# EAGLE design OpAmp_NonInvertente (EAGLE 7.2.0)
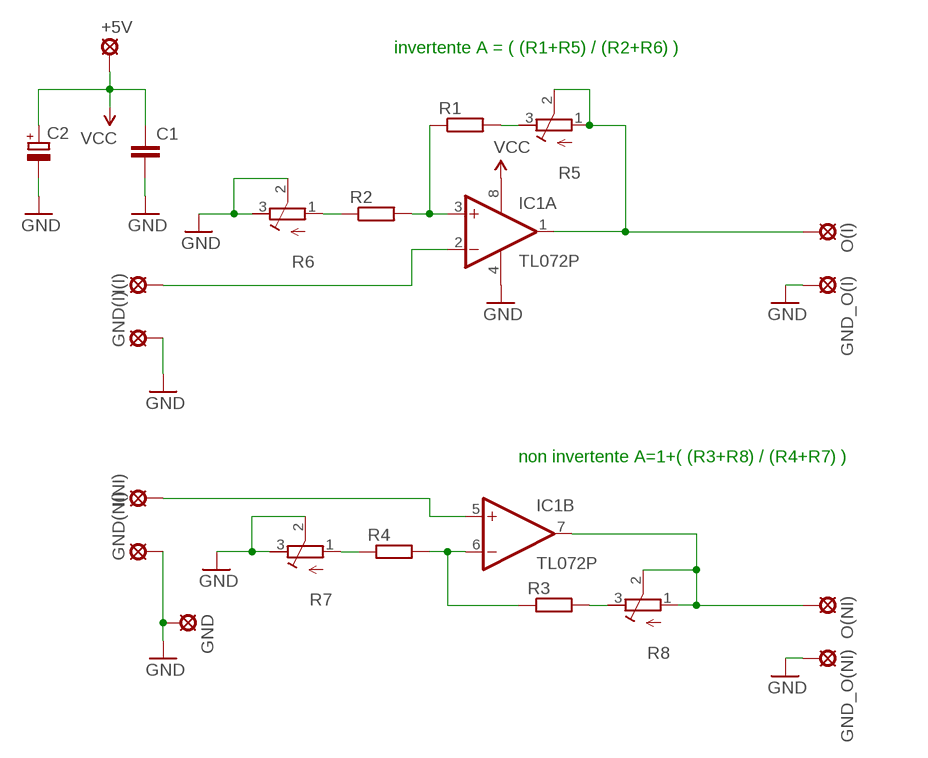
[diagram p0: schematic, sheet 1]

## Parts
+5V  LSP10  [LSP10]
C1  C-EU025-024X044  [C025-024X044]
C2  CPOL-EUE2.5-6  [E2,5-6]
GND  LSP10  [LSP10]
GND(I)  LSP10  [LSP10]
GND(NI)  LSP10  [LSP10]
GND_O(I)  LSP10  [LSP10]
GND_O(NI)  LSP10  [LSP10]
I(I)  LSP10  [LSP10]
I(NI)  LSP10  [LSP10]
IC1  TL072P  [DIL08]
O(I)  LSP10  [LSP10]
O(NI)  LSP10  [LSP10]
R1  R-EU_0309/10  [0309/10]
R2  R-EU_0309/10  [0309/10]
R3  R-EU_0309/10  [0309/10]
R4  R-EU_0309/10  [0309/10]
R5  R-TRIMM3339P  [RTRIM3339P]
R6  R-TRIMM3339P  [RTRIM3339P]
R7  R-TRIMM3339P  [RTRIM3339P]
R8  R-TRIMM3339P  [RTRIM3339P]

## Nets
GND: C1.2 C2.- GND(I).MP GND(NI).MP GND.MP GND_O(I).MP GND_O(NI).MP IC1.4(P:V-) R6.2(S) R6.3(E) R7.2(S) R7.3(E)
N$2: R2.1 R6.1(A)
N$3: IC1.3(A:+IN) R1.1 R2.2
N$4: R1.2 R5.3(E)
N$5: IC1.1(A:OUT) O(I).MP R5.1(A) R5.2(S)
N$7: IC1.6(B:-IN) R3.1 R4.2
N$8: R4.1 R7.1(A)
N$11: R3.2 R8.3(E)
N$12: IC1.7(B:OUT) O(NI).MP R8.1(A) R8.2(S)
N$13: I(NI).MP IC1.5(B:+IN)
N$14: I(I).MP IC1.2(A:-IN)
VCC: +5V.MP C1.1 C2.+ IC1.8(P:V+)

## Notes on the sheet
- invertente A = ( (R1+R5) / (R2+R6) )
- non invertente A=1+( (R3+R8) / (R4+R7) )

## Library data of the parts
+5V GND GND(I) GND(NI) GND_O(I) GND_O(NI) I(I) I(NI) O(I) O(NI) = solpad:LSP10: SOLDER PAD drill 1.0 mm, distributor Buerklin, 12H555
C1 = rcl:C-EU: CAPACITOR, European symbol
C2 = rcl:CPOL-EU: POLARIZED CAPACITOR, European symbol
IC1 = linear:TL072: OP AMP
R1-R4 = rcl:R-EU_: RESISTOR, European symbol
R5-R8 = rcl:R-TRIMM: Trimm resistor

## Board
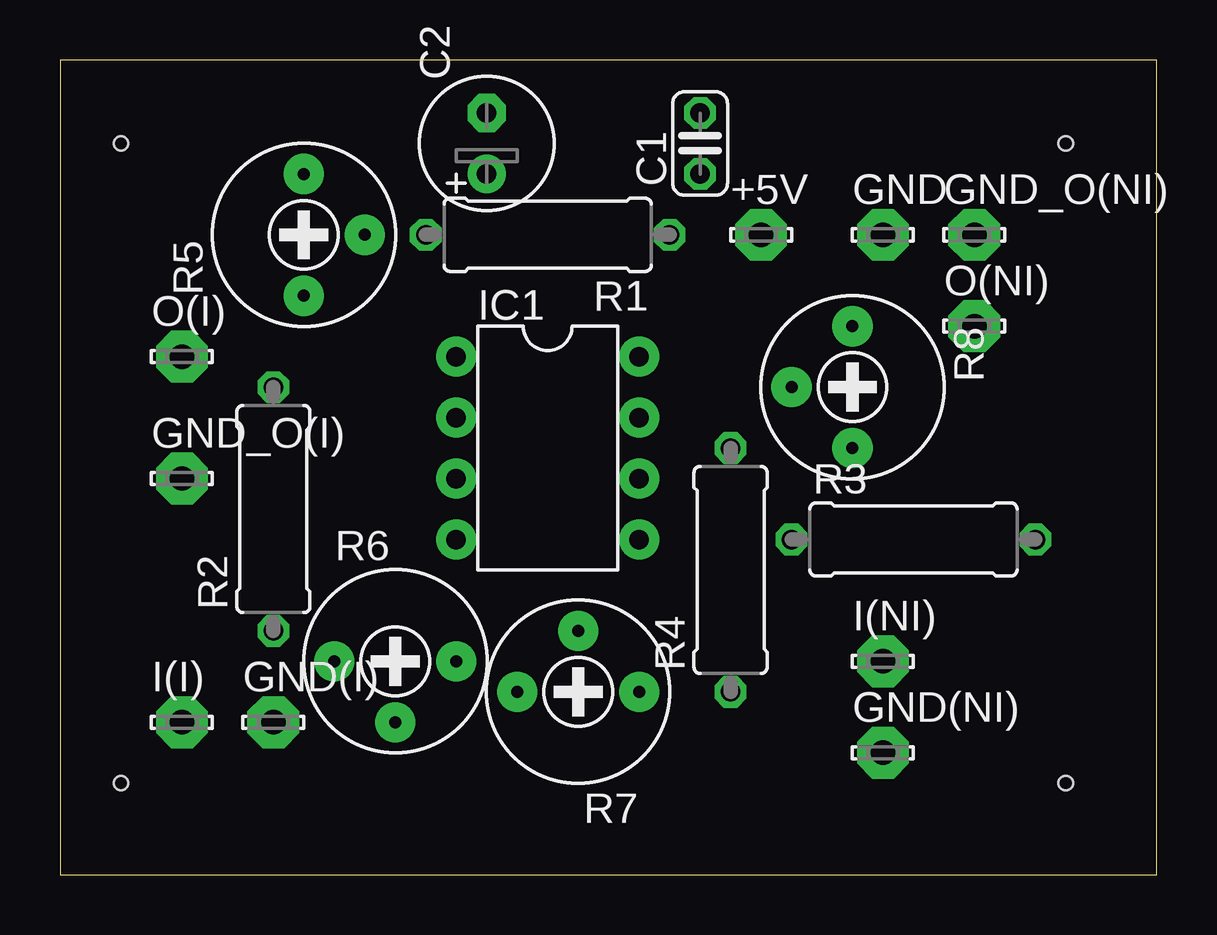
[diagram p1: board, top side]
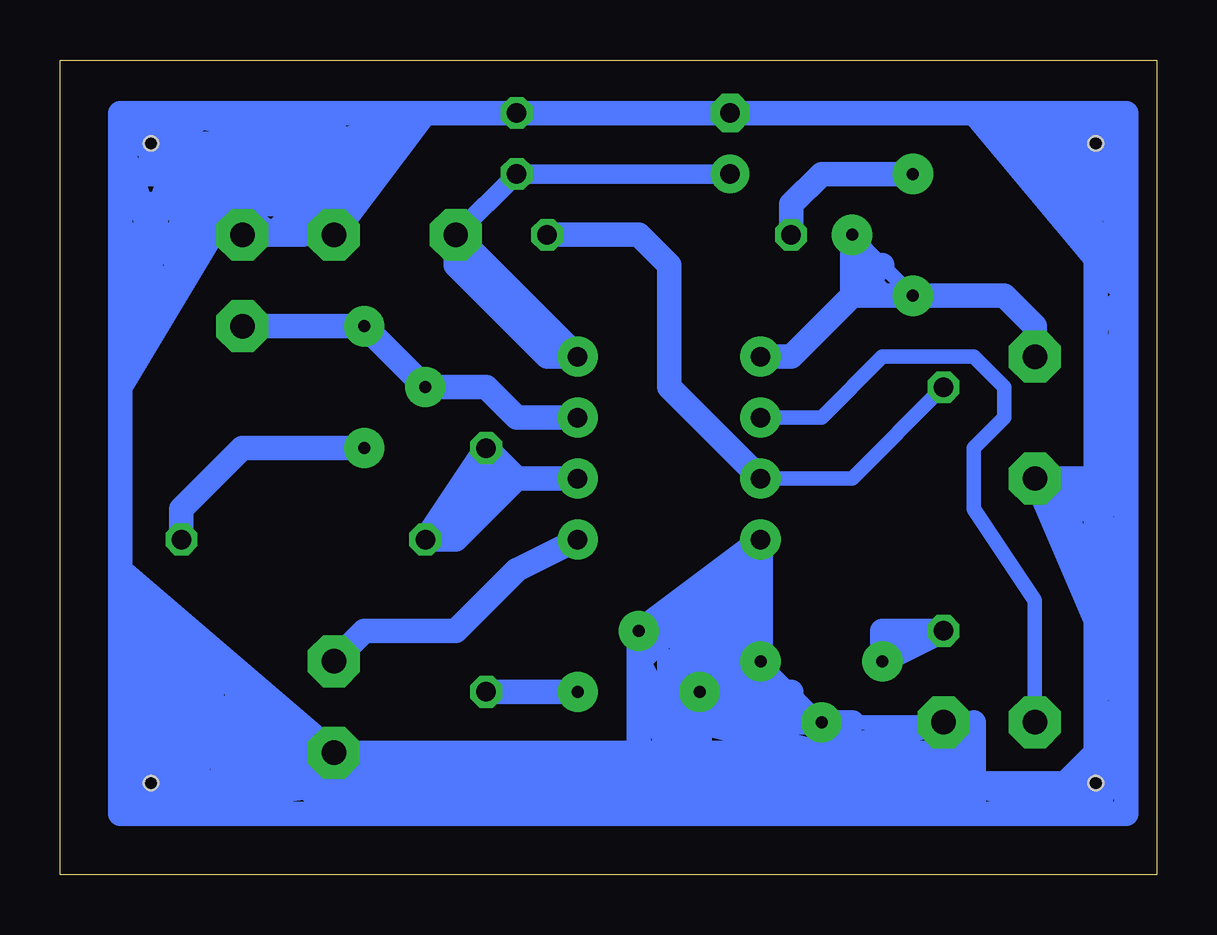
[diagram p2: board, bottom side, seen from below]

Size 45.7 x 33.96 mm. Coordinates in mm from the lower left corner, seen from the top.
Outline: 0,0 45.7,0 45.7,33.96 0,33.96 0,0
Copper layers (1*16): Top 0.035mm / dielectric 1.5mm / Bottom 0.035mm
Design rules "default": minimum track width 10mil, minimum drill 24mil, track to track 8mil, track to pad 8mil, pad to pad 8mil, via to via 8mil, smd to smd 8mil, copper to edge 40mil, drill to drill 8mil, minimum pad ring 10mil, minimum via ring 8mil, stop-mask expansion 4mil, vias tented up to drill 0mil, thermal gap 10mil
Holes 0.6 mm at 2.54,30.48 2.54,3.81 41.91,3.81 41.91,30.48

### Footprints (pad centres in the part's own frame; a part is rotated, then mirrored left to right if it is on the bottom)
LSP10 = drill 1.016 pad 2.159 octagon: MP 0,0
C025-024X044 = drill 0.813 octagon: 1 -1.27,0; 2 1.27,0
E2,5-6 = drill 0.813 pad 1.6: + -1.27,0 | drill 0.813 pad 1.6 octagon: - 1.27,0
DIL08 = drill 0.813 pad 1.676: 1 -3.81,-3.81; 2 -1.27,-3.81; 3 1.27,-3.81; 4 3.81,-3.81; 5 3.81,3.81; 6 1.27,3.81; 7 -1.27,3.81; 8 -3.81,3.81
0309/10 = drill 0.813 octagon: 1 -5.08,0; 2 5.08,0
RTRIM3339P = drill 0.5 pad 1.676: 1 -2.54,0; 2 0,-2.54; 3 2.54,0

### Placement (x,y rotation side)
+5V  29.21,26.67 0 top
C1  26.67,30.48 90 top
C2  17.78,30.48 90 top
GND  34.29,26.67 0 top
GND(I)  8.89,6.35 0 top
GND(NI)  34.29,5.08 0 top
GND_O(I)  5.08,16.51 0 top
GND_O(NI)  38.1,26.67 0 top
I(I)  5.08,6.35 0 top
I(NI)  34.29,8.89 0 top
IC1  20.32,17.78 270 top
O(I)  5.08,21.59 0 top
O(NI)  38.1,22.86 0 top
R1  20.32,26.67 180 top
R2  8.89,15.24 90 top
R3  35.56,13.97 0 top
R4  27.94,12.7 90 top
R5  10.16,26.67 90 top
R6  13.97,8.89 0 top
R7  21.59,7.62 180 top
R8  33.02,20.32 270 top

### Tracks (layer width: path | path; a pad name or v marks a point on that pad's centre or on a via)
GND
  Bottom 0.61: GND.MP 35.56,26.67 36.83,26.67 GND_O(NI).MP | R7.3 17.78,7.62 R6.3 15.24,7.62 R6.2 | 16.51,12.7 16.51,10.16 | 12.7,6.35 GND(I).MP | 20.32,5.08 19.05,6.35 R7.3 | R7.3 19.05,8.89
  Bottom 1.016: 3.81,31.75 1.27,31.75 1.27,30.48 | 3.81,31.75 5.08,31.75 | 5.08,31.75 6.35,31.75 | 6.35,31.75 7.62,31.75 | 7.62,31.75 C2.- C1.2 30.48,31.75 | 30.48,31.75 34.29,31.75 | 34.29,31.75 35.56,31.75 | 35.56,31.75 39.37,31.75 | 39.37,31.75 40.64,31.75 | 40.64,31.75 43.18,31.75 43.18,30.48 | 43.18,30.48 43.18,29.21 | 43.18,29.21 43.18,27.94 | 43.18,27.94 43.18,26.67 | 43.18,26.67 43.18,25.4 | 43.18,25.4 43.18,20.32 | 43.18,20.32 43.18,12.7 | 43.18,12.7 43.18,11.43 | 43.18,11.43 43.18,3.81 | 43.18,2.54 41.91,2.54 | 41.91,2.54 39.37,2.54 | 39.37,2.54 34.29,2.54 | 34.29,2.54 8.89,2.54 | 8.89,2.54 7.62,2.54 | 7.62,2.54 5.08,2.54 | 5.08,2.54 3.81,2.54 | 3.81,2.54 2.54,2.54 | 2.54,2.54 1.27,2.54 1.27,6.35 | 1.27,6.35 1.27,7.62 | 1.27,7.62 1.27,15.24 | 1.27,15.24 1.27,16.51 | 1.27,16.51 1.27,24.13 | 1.27,24.13 1.27,26.67 | 1.27,26.67 1.27,30.48 | 3.81,16.51 GND_O(I).MP 1.27,7.62 | 3.81,16.51 2.54,16.51 | 2.54,16.51 1.27,16.51 | 39.37,26.67 GND_O(NI).MP 35.56,26.67 35.56,27.94 | 39.37,26.67 40.64,26.67 | 40.64,26.67 41.91,26.67 | 41.91,26.67 43.18,26.67 | 8.89,5.08 GND(I).MP 13.97,5.08 | 8.89,5.08 8.89,3.81 | 8.89,3.81 8.89,2.54 | R6.2 15.24,6.35 | 15.24,6.35 16.51,6.35 | 16.51,6.35 19.05,6.35 | R6.3 16.51,7.62 | 16.51,7.62 16.51,6.35 | 15.24,6.35 15.24,7.62 16.51,7.62 | 16.51,7.62 17.78,7.62 19.05,6.35 | 19.05,6.35 16.51,7.62 | 16.51,7.62 15.24,6.35 | GND(NI).MP 34.29,3.81 | 34.29,2.54 34.29,3.81 | 8.89,5.08 12.7,5.08 | 12.7,5.08 13.97,5.08 | 19.05,5.08 20.32,5.08 | 20.32,5.08 21.59,5.08 | 21.59,5.08 GND(NI).MP | 7.62,2.54 7.62,3.81 | 7.62,3.81 7.62,6.35 8.89,3.81 | 8.89,3.81 7.62,2.54 | 13.97,5.08 19.05,6.35 | 19.05,6.35 19.05,5.08 | 19.05,5.08 13.97,5.08 | 12.7,5.08 R6.2 | R6.2 12.7,6.35
  Bottom 1.016: 1.27,7.62 2.54,16.51 | 2.54,16.51 3.81,15.24 | 3.81,15.24 2.54,11.43 | 2.54,11.43 2.54,15.24 | 2.54,15.24 3.81,15.24 | 3.81,15.24 3.81,16.51 | 3.81,16.51 1.27,15.24 | 34.29,27.94 GND.MP 30.48,31.75 | 34.29,27.94 34.29,29.21 | 34.29,30.48 34.29,31.75 | 43.18,30.48 41.91,30.48 | 41.91,30.48 40.64,30.48 | 40.64,30.48 39.37,30.48 | 39.37,30.48 34.29,30.48 | 34.29,29.21 36.83,29.21 | 36.83,29.21 40.64,29.21 | 40.64,29.21 41.91,29.21 | 41.91,29.21 43.18,29.21 | 43.18,27.94 40.64,27.94 | 40.64,27.94 36.83,27.94 | 36.83,27.94 35.56,27.94 | 35.56,27.94 34.29,27.94 | 35.56,31.75 35.56,27.94 | 35.56,27.94 34.29,30.48 | 34.29,30.48 40.64,31.75 | 40.64,31.75 43.18,30.48 | 43.18,30.48 41.91,26.67 | 41.91,26.67 40.64,30.48 | 40.64,30.48 41.91,29.21 | 41.91,29.21 41.91,30.48 | 41.91,30.48 39.37,31.75 | 39.37,31.75 34.29,30.48 | 34.29,30.48 40.64,29.21 | 40.64,29.21 39.37,30.48 | 39.37,30.48 39.37,26.67 | 39.37,26.67 40.64,27.94 | 40.64,27.94 40.64,26.67 | 40.64,27.94 40.64,29.21 | 40.64,29.21 36.83,27.94 | 36.83,27.94 36.83,29.21 | 36.83,29.21 35.56,27.94 | 35.56,27.94 40.64,29.21 | 40.64,29.21 36.83,26.67 35.56,27.94 | GND(NI).MP 43.18,12.7 | 43.18,12.7 41.91,2.54 | 41.91,2.54 38.1,7.62 | 38.1,7.62 41.91,10.16 40.64,6.35 | 40.64,6.35 39.37,2.54 | 39.37,2.54 38.1,7.62 | 38.1,7.62 35.56,3.81 36.83,3.81 | 36.83,3.81 38.1,3.81 | 38.1,3.81 40.64,3.81 | 40.64,3.81 43.18,3.81 | 43.18,3.81 43.18,2.54 | 43.18,2.54 34.29,3.81 | 34.29,3.81 36.83,6.35 36.83,5.08 | 36.83,5.08 36.83,3.81 | 36.83,3.81 39.37,6.35 | 39.37,6.35 40.64,7.62 40.64,8.89 39.37,6.35 | 39.37,6.35 39.37,8.89 43.18,11.43 | 43.18,11.43 40.64,3.81 | 40.64,3.81 41.91,5.08 43.18,2.54 | 43.18,2.54 39.37,5.08 | 39.37,5.08 40.64,6.35
  Bottom 1.016: 39.37,5.08 38.1,3.81 | 38.1,3.81 38.1,6.35 36.83,5.08 | 36.83,5.08 34.29,2.54 | 7.62,31.75 1.27,24.13 | 1.27,24.13 2.54,26.67 | 2.54,26.67 3.81,29.21 | 3.81,29.21 5.08,31.75 | 5.08,31.75 6.35,30.48 3.81,29.21 | 3.81,29.21 6.35,31.75 | 6.35,31.75 3.81,27.94 3.81,29.21 | 3.81,29.21 3.81,30.48 | 3.81,30.48 3.81,31.75 | 3.81,31.75 1.27,30.48 | 1.27,30.48 3.81,29.21 | 3.81,29.21 2.54,30.48 | 2.54,30.48 3.81,30.48 | 3.81,30.48 1.27,26.67 | 2.54,30.48 1.27,26.67 | 1.27,26.67 2.54,26.67 | 2.54,26.67 2.54,22.86 | 2.54,22.86 2.54,15.24 | 2.54,15.24 1.27,24.13 | 1.27,24.13 2.54,22.86 | 5.08,2.54 2.54,5.08 | 1.27,6.35 2.54,2.54 | 2.54,2.54 2.54,3.81 | 2.54,3.81 3.81,2.54 | 3.81,2.54 7.62,3.81 | 7.62,3.81 2.54,3.81 | 2.54,3.81 2.54,5.08 | 2.54,5.08 2.54,11.43 | 2.54,11.43 1.27,6.35 | 1.27,6.35 2.54,5.08 | 2.54,5.08 1.27,7.62 | 39.37,26.67 43.18,20.32 | 43.18,20.32 41.91,26.67 | 41.91,26.67 40.64,25.4 | 40.64,25.4 40.64,26.67 | 40.64,26.67 43.18,25.4 | 43.18,25.4 41.91,22.86 41.91,24.13 | 41.91,26.67 41.91,24.13 | 41.91,24.13 40.64,25.4 | 30.48,31.75 34.29,30.48 | 34.29,30.48 34.29,29.21 | 34.29,27.94 33.02,30.48 31.75,30.48 33.02,29.21 35.56,31.75 | R7.2 21.59,8.89 | 21.59,5.08 21.59,8.89 | 21.59,8.89 20.32,10.16 | 20.32,10.16 19.05,8.89 17.78,8.89 | 17.78,8.89 R6.3 | R6.3 R7.3 | R7.3 20.32,8.89 20.32,6.35 21.59,8.89 | 21.59,8.89 20.32,5.08 | 20.32,5.08 R7.3 | IC1.4 R7.2 | R7.2 20.32,10.16 | 20.32,10.16 19.05,10.16 | 19.05,10.16 17.78,10.16 | 17.78,10.16 16.51,10.16 R6.3 | R6.3 16.51,12.7 | 16.51,12.7 IC1.4 | IC1.4 17.78,12.7 | 17.78,12.7 20.32,10.16 | 20.32,10.16 17.78,8.89 | 17.78,8.89 17.78,10.16 | 17.78,10.16 17.78,12.7 | 17.78,12.7 19.05,10.16 | 19.05,10.16 16.51,12.7 | 16.51,12.7 17.78,10.16
  Bottom 1.016: 17.78,10.16 R6.3
  Bottom 1.676: 34.29,3.81 8.89,3.81
N$2
  Bottom 1.016: R6.1 R2.1 11.43,10.16 R6.1
N$3
  Bottom 0.61: R2.2 12.7,16.51 IC1.3
  Bottom 1.016: R1.1 21.59,26.67 20.32,25.4 20.32,20.32 IC1.3
N$4
  Bottom 1.016: R5.3 13.97,29.21 15.24,27.94 R1.2
N$5
  Bottom 0.61: R5.1 11.43,25.4 R5.2
  Bottom 1.016: R5.2 12.7,25.4 | 12.7,25.4 12.7,24.13 | 12.7,24.13 11.43,25.4 12.7,25.4 | 12.7,25.4 11.43,24.13 | 11.43,24.13 R5.1 6.35,24.13 5.08,22.86 O(I).MP | 11.43,24.13 12.7,24.13 | 12.7,24.13 15.24,21.59 IC1.1
N$7
  Bottom 0.61: 26.67,16.51 27.94,16.51 | 27.94,16.51 R4.2 | R3.1 29.21,15.24 27.94,16.51
  Bottom 1.016: IC1.6 26.67,16.51 | 26.67,16.51 29.21,13.97 | 29.21,13.97 R3.1 R4.2 26.67,16.51 | 26.67,16.51 29.21,15.24 29.21,13.97
N$8
  Bottom 1.016: R7.1 R4.1
N$11
  Bottom 1.016: R8.3 38.1,17.78 40.64,15.24 R3.2
N$12
  Bottom 1.016: IC1.7 26.67,19.05 27.94,20.32 R8.2 R8.1 O(NI).MP
N$13
  Bottom 1.016: IC1.5 26.67,12.7 29.21,10.16 33.02,10.16 I(NI).MP
N$14
  Bottom 0.61: I(I).MP 5.08,11.43 7.62,15.24 7.62,17.78 6.35,19.05 6.35,20.32 7.62,21.59 11.43,21.59 13.97,19.05 IC1.2
VCC
  Bottom 0.813: C2.+ C1.1 +5V.MP
  Bottom 1.016: IC1.8 25.4,21.59 27.94,24.13 | 27.94,24.13 29.21,25.4 +5V.MP | +5V.MP 27.94,25.4 27.94,24.13 | 27.94,24.13 IC1.8 | IC1.8 +5V.MP